# Altium schematic sheet 8pins_together.SchDoc
size A3; DocumentNumber: 3; SheetNumber: 3; SheetTotal: 5
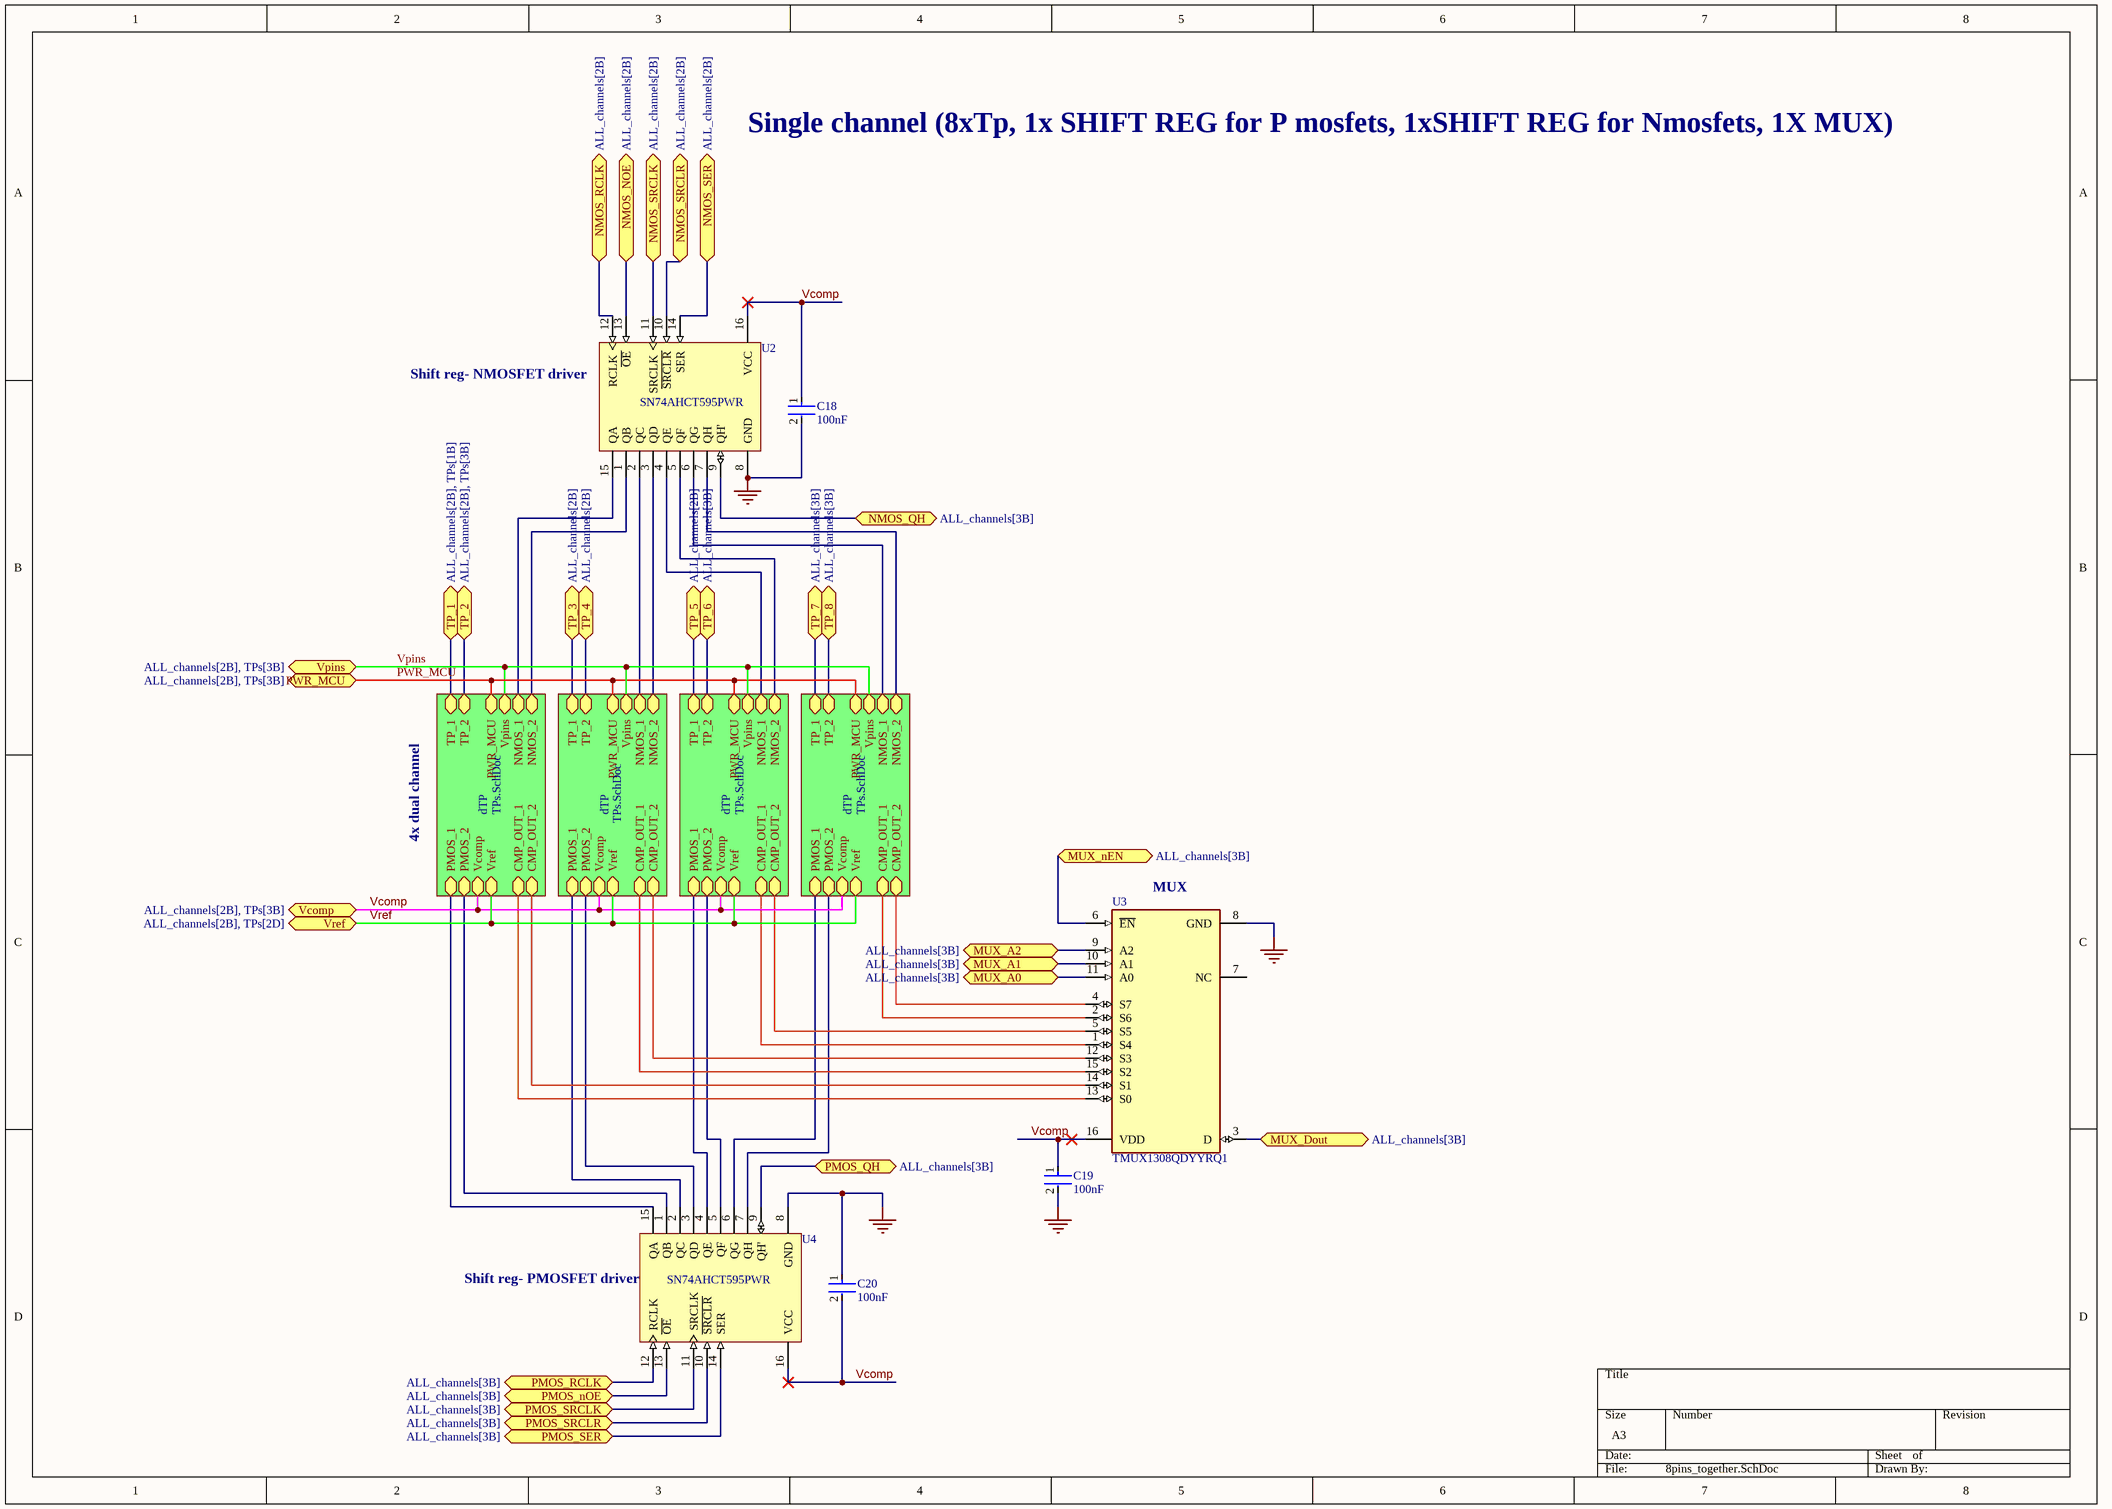
[diagram p0: 8pins_together.SchDoc]

## Parts
C18  100nF  [0402 CAP]
C19  100nF  [0402 CAP]
C20  100nF  [0402 CAP]
U2  SN74AHCT595PWR  [SSOT16]
U3  TMUX1308QDYYRQ1  [FP-DYY0016A-MFG]
U4  SN74AHCT595PWR  [SSOT16]

## Sub-sheets
dTP = TPs.SchDoc: PMOS_1 (bidir), CMP_OUT_1 (bidir), NMOS_2 (bidir), CMP_OUT_2 (bidir), PMOS_2 (bidir), NMOS_1 (bidir), TP_2 (bidir), TP_1 (bidir), Vcomp (bidir), PWR_MCU (bidir), Vref (bidir), Vpins (bidir)
dTP = TPs.SchDoc: PMOS_1 (bidir), CMP_OUT_1 (bidir), NMOS_2 (bidir), CMP_OUT_2 (bidir), PMOS_2 (bidir), NMOS_1 (bidir), TP_2 (bidir), TP_1 (bidir), Vcomp (bidir), PWR_MCU (bidir), Vref (bidir), Vpins (bidir)
dTP = TPs.SchDoc: PMOS_1 (bidir), CMP_OUT_1 (bidir), NMOS_2 (bidir), CMP_OUT_2 (bidir), PMOS_2 (bidir), NMOS_1 (bidir), TP_2 (bidir), TP_1 (bidir), Vcomp (bidir), PWR_MCU (bidir), Vref (bidir), Vpins (bidir)
dTP = TPs.SchDoc: PMOS_1 (bidir), CMP_OUT_1 (bidir), NMOS_2 (bidir), CMP_OUT_2 (bidir), PMOS_2 (bidir), NMOS_1 (bidir), TP_2 (bidir), TP_1 (bidir), Vcomp (bidir), PWR_MCU (bidir), Vref (bidir), Vpins (bidir)

## Ports
MUX_A0 (bidir, see ALL_channels[3B]), MUX_A1 (bidir, see ALL_channels[3B]), MUX_A2 (bidir, see ALL_channels[3B]), MUX_Dout (bidir, see ALL_channels[3B]), MUX_nEN (bidir, see ALL_channels[3B]), NMOS_NOE (bidir, see ALL_channels[2B]), NMOS_QH (bidir, see ALL_channels[3B]), NMOS_RCLK (bidir, see ALL_channels[2B]), NMOS_SER (bidir, see ALL_channels[2B]), NMOS_SRCLK (bidir, see ALL_channels[2B]), NMOS_SRCLR (bidir, see ALL_channels[2B]), PMOS_nOE (bidir, see ALL_channels[3B]), PMOS_QH (bidir, see ALL_channels[3B]), PMOS_RCLK (bidir, see ALL_channels[3B]), PMOS_SER (bidir, see ALL_channels[3B]), PMOS_SRCLK (bidir, see ALL_channels[3B]), PMOS_SRCLR (bidir, see ALL_channels[3B]), PWR_MCU (bidir, see ALL_channels[2B], TPs[3B]), TP_1 (bidir, see ALL_channels[2B], TPs[1B]), TP_2 (bidir, see ALL_channels[2B], TPs[3B]), TP_3 (bidir, see ALL_channels[2B]), TP_4 (bidir, see ALL_channels[2B]), TP_5 (bidir, see ALL_channels[2B]), TP_6 (bidir, see ALL_channels[3B]), TP_7 (bidir, see ALL_channels[3B]), TP_8 (bidir, see ALL_channels[3B]), Vcomp (bidir, see ALL_channels[2B], TPs[3B]), Vpins (bidir, see ALL_channels[2B], TPs[3B]), Vref (bidir, see ALL_channels[2B], TPs[2D])

## Nets
GND: C18.2 C19.2 C20.1 U2.8(GND) U3.8(GND) U4.8(GND)
MUX_A0: U3.11(A0) ; port MUX_A0
MUX_A1: U3.10(A1) ; port MUX_A1
MUX_A2: U3.9(A2) ; port MUX_A2
MUX_Dout: U3.3(D) ; port MUX_Dout
MUX_nEN: U3.6(~{EN}) ; port MUX_nEN
NMOS_NOE: U2.13(~{OE}) ; port NMOS_NOE
NMOS_QH: U2.9(QH') ; port NMOS_QH
NMOS_RCLK: U2.12(RCLK) ; port NMOS_RCLK
NMOS_SER: U2.14(SER) ; port NMOS_SER
NMOS_SRCLK: U2.11(SRCLK) ; port NMOS_SRCLK
NMOS_SRCLR: U2.10(~{SRCLR}) ; port NMOS_SRCLR
PMOS_nOE: U4.13(~{OE}) ; port PMOS_nOE
PMOS_QH: U4.9(QH') ; port PMOS_QH
PMOS_RCLK: U4.12(RCLK) ; port PMOS_RCLK
PMOS_SER: U4.14(SER) ; port PMOS_SER
PMOS_SRCLK: U4.11(SRCLK) ; port PMOS_SRCLK
PMOS_SRCLR: U4.10(~{SRCLR}) ; port PMOS_SRCLR
PWR_MCU: port PWR_MCU, sheet dTP/PWR_MCU, sheet dTP/PWR_MCU, sheet dTP/PWR_MCU, sheet dTP/PWR_MCU
TP_1: port TP_1, sheet dTP/TP_1
TP_2: port TP_2, sheet dTP/TP_2
TP_3: port TP_3, sheet dTP/TP_1
TP_4: port TP_4, sheet dTP/TP_2
TP_5: port TP_5, sheet dTP/TP_1
TP_6: port TP_6, sheet dTP/TP_2
TP_7: port TP_7, sheet dTP/TP_1
TP_8: port TP_8, sheet dTP/TP_2
Vcomp: C18.1 C19.1 C20.2 U2.16(VCC) U3.16(VDD) U4.16(VCC) ; port Vcomp, sheet dTP/Vcomp, sheet dTP/Vcomp, sheet dTP/Vcomp, sheet dTP/Vcomp
Vpins: port Vpins, sheet dTP/Vpins, sheet dTP/Vpins, sheet dTP/Vpins, sheet dTP/Vpins
Vref: port Vref, sheet dTP/Vref, sheet dTP/Vref, sheet dTP/Vref, sheet dTP/Vref
NetU2_1: U2.1(QB) ; sheet dTP/NMOS_2
NetU2_2: U2.2(QC) ; sheet dTP/NMOS_1
NetU2_3: U2.3(QD) ; sheet dTP/NMOS_2
NetU2_4: U2.4(QE) ; sheet dTP/NMOS_1
NetU2_5: U2.5(QF) ; sheet dTP/NMOS_2
NetU2_6: U2.6(QG) ; sheet dTP/NMOS_1
NetU2_7: U2.7(QH) ; sheet dTP/NMOS_2
NetU2_15: U2.15(QA) ; sheet dTP/NMOS_1
NetU3_1: U3.1(S4) ; sheet dTP/CMP_OUT_1
NetU3_2: U3.2(S6) ; sheet dTP/CMP_OUT_1
NetU3_4: U3.4(S7) ; sheet dTP/CMP_OUT_2
NetU3_5: U3.5(S5) ; sheet dTP/CMP_OUT_2
NetU3_12: U3.12(S3) ; sheet dTP/CMP_OUT_2
NetU3_13: U3.13(S0) ; sheet dTP/CMP_OUT_1
NetU3_14: U3.14(S1) ; sheet dTP/CMP_OUT_2
NetU3_15: U3.15(S2) ; sheet dTP/CMP_OUT_1
NetU4_1: U4.1(QB) ; sheet dTP/PMOS_2
NetU4_2: U4.2(QC) ; sheet dTP/PMOS_1
NetU4_3: U4.3(QD) ; sheet dTP/PMOS_2
NetU4_4: U4.4(QE) ; sheet dTP/PMOS_1
NetU4_5: U4.5(QF) ; sheet dTP/PMOS_2
NetU4_6: U4.6(QG) ; sheet dTP/PMOS_1
NetU4_7: U4.7(QH) ; sheet dTP/PMOS_2
NetU4_15: U4.15(QA) ; sheet dTP/PMOS_1

Not connected (* = marked no-connect by the designer): U3 7(NC)

## Notes on the sheet
- Single channel (8xTp, 1x SHIFT REG for P mosfets, 1xSHIFT REG for Nmosfets, 1X MUX)
- (near U2) Shift reg- NMOSFET driver
- 4x dual channel
- (near U3) MUX
- (near U4) Shift reg- PMOSFET driver

## Library data of the parts
C18-C20 = Capacitor 0402 25V: Cap Ceramic 0.1uF 25V X7R 10% Pad SMD 0402 125C T/R; Manufacturer: Kemet; Manufacturer Part Number: C0402C104K3RACTU; Value: 0.10 μF; Temperature Coefficient: 15%; Tolerance: 0.1; Temperature: -55°C to +125°C; Automotive: No; Height: 0.55mm; Package: C0402-BB; Category: Cap; Temperature Range Low: -55°C; Device Class L2: Capacitors; Temperature Characteristic: X7R; Lead Free: Yes; Material: Ceramic; Mouser Description: Cap Ceramic 0.1uF 25V X7R 10% Pad SMD 0402 125C T/R; Temperature Range High: +125°C; Digikey Description: Cap Ceramic 0.1uF 25V X7R 10% Pad SMD 0402 125C T/R; Ipc Land Pattern Name: CAPC10050X50; Voltage Rating: 25 V; ComponentLink2URL: https://content.kemet.com/datasheets/KEM_C1002_X7R_SMD.pdf; Device Class L3: Ceramic Capacitors; RoHS: TRUE; Capacitance: 0.10 μF; Device Class L1: Passive Components; Octopart: https://octopart.com/c0402c104k3ractu-kemet-71105629; ComponentLink2Description: Datasheet
U2 U4 = SN74AHCT595PWR: 8-Bit Shift Registers With 3-State Output Registers, PW0016A, LARGE T&R; Manufacturer: Texas Instruments; F @ Nom Voltage(Max)(Mhz): 70; Bits: 8; Output Drive (IOL/IOH)(Max)(mA): 8/-8; Technology Family: AHCT; ICC @ Nom Voltage(Max)(mA): 0.04; 3-State Output: Yes; VCC(Max)(V): 5.5; Voltage(Nom)(V): 5; VCC(Min)(V): 4.5; Output Type: CMOS; Rating: Catalog; Input Type: TTL; tpd @ Nom Voltage(Max)(ns): 11.4; PackageVersion: http://www.ti.com/lit/ml/mpds361/mpds361.pdf; PackageReference: PW0016A; Code_JEDEC: MO-153; Operating Temperature Range(C): -40 to 85; DatasheetVersion: SCLS374N; Generic Part Number: SN74AHCT595
U3 = TMUX1308QDYYRQ1: AUTOMOTIVE, 5-V, 8:1, 1-CHANNEL; RoHS Compliant: Yes